# Altium schematic sheet 集成隔离器（4）.SchDoc
size A4
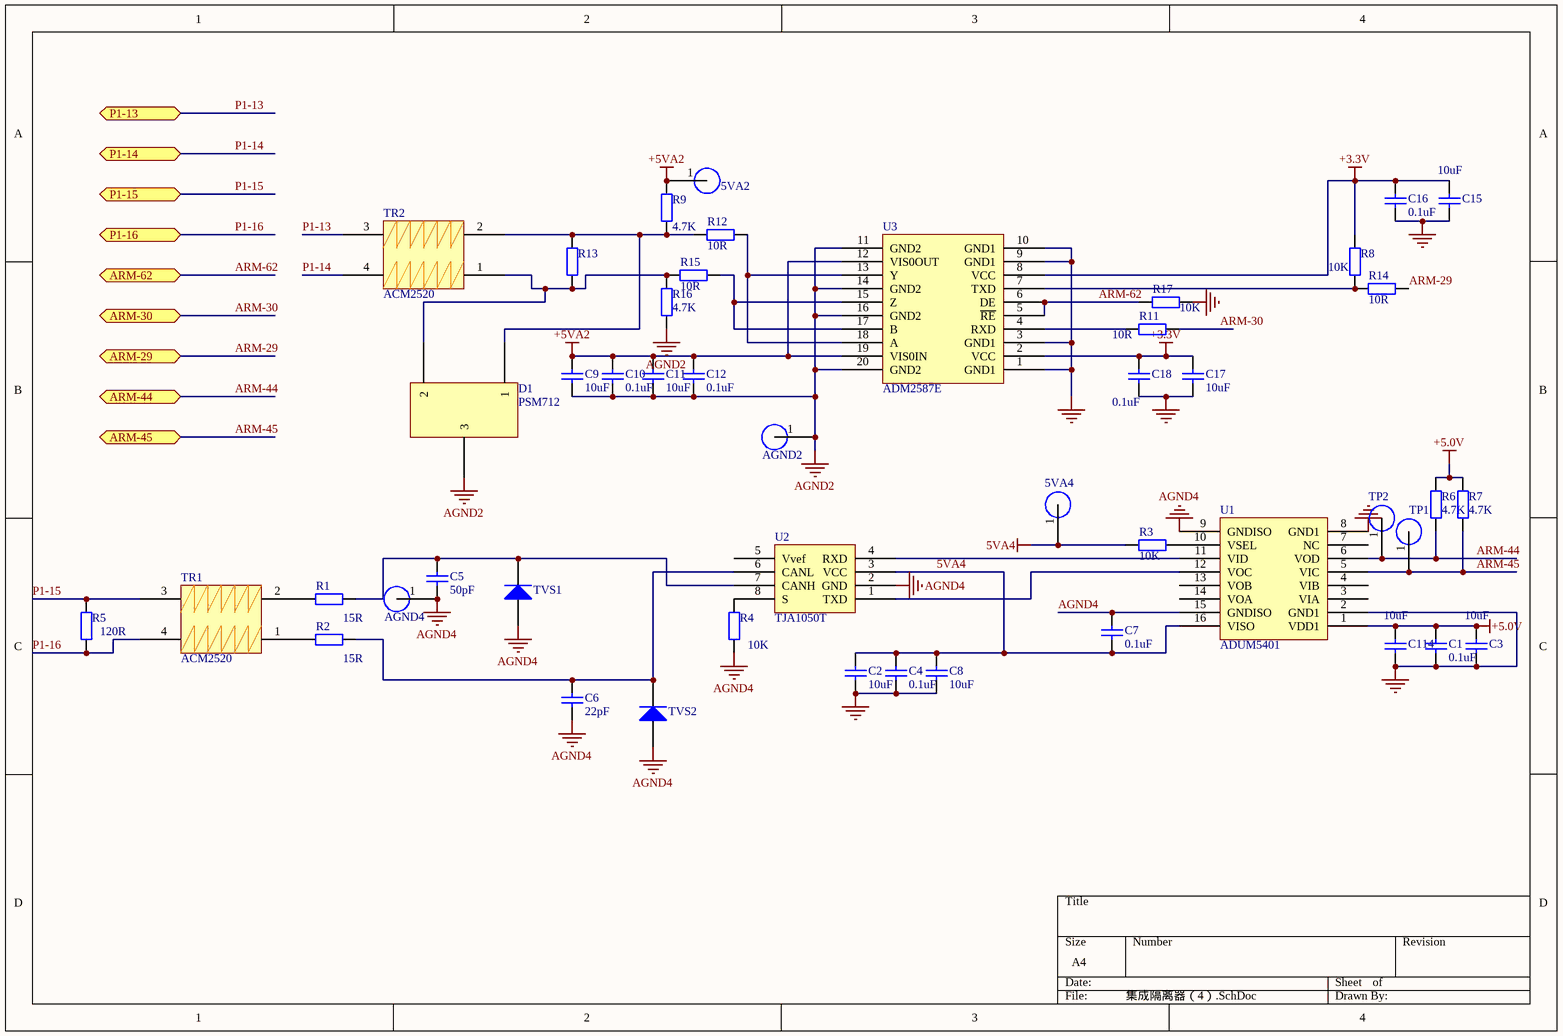
[diagram p0: 集成隔离器（4）.SchDoc]

## Parts
5VA2  PIN  [圆形焊盘]  (value not drawn)
5VA4  PIN  [圆形焊盘]  (value not drawn)
AGND2  PIN  [圆形焊盘]  (value not drawn)
AGND4  PIN  [圆形焊盘]  (value not drawn)
C1  value 0.1uF  [C0805]  (hidden comment: Cap)
C2  value 10uF  [C1206]  (hidden comment: Cap)
C3  value 10uF  [C1206]  (hidden comment: Cap)
C4  value 0.1uF  [C0805]  (hidden comment: Cap)
C5  value 50pF  [C0805]  (hidden comment: Cap)
C6  value 22pF  [C0805]  (hidden comment: Cap)
C7  value 0.1uF  [C0805]  (hidden comment: Cap)
C8  value 10uF  [C1206]  (hidden comment: Cap)
C9  value 10uF  [C1206]  (hidden comment: Cap)
C10  value 0.1uF  [C0805]  (hidden comment: Cap)
C11  value 10uF  [C1206]  (hidden comment: Cap)
C12  value 0.1uF  [C0805]  (hidden comment: Cap)
C15  value 10uF  [C1206]  (hidden comment: Cap)
C16  value 0.1uF  [C0805]  (hidden comment: Cap)
C17  value 10uF  [C1206]  (hidden comment: Cap)
C18  value 0.1uF  [C0805]  (hidden comment: Cap)
C114  value 10uF  [C1206]  (hidden comment: Cap)
D1  PSM712  [SOT23-3]
R1  value 15R  [R0805]  (hidden comment: Res2)
R2  value 15R  [R0805]  (hidden comment: Res2)
R3  value 10K  [R0805]  (hidden comment: Res2)
R4  value 10K  [R0805]  (hidden comment: Res2)
R5  value 120R  [R0805]  (hidden comment: Res2)
R6  value 4.7K  [R0805]  (hidden comment: Res2)
R7  value 4.7K  [R0805]  (hidden comment: Res2)
R8  value 10K  [R0805]  (hidden comment: Res2)
R9  value 4.7K  [R0805]  (hidden comment: Res2)
R11  value 10R  [R0805]  (hidden comment: Res2)
R12  value 10R  [R0805]  (hidden comment: Res2)
R13  Res2  [R0805]  (value not drawn)
R14  value 10R  [R0805]  (hidden comment: Res2)
R15  value 10R  [R0805]  (hidden comment: Res2)
R16  value 4.7K  [R0805]  (hidden comment: Res2)
R17  value 10K  [R0805]  (hidden comment: Res2)
TP1  PIN  [圆形焊盘]  (value not drawn)
TP2  PIN  [圆形焊盘]  (value not drawn)
TR1  ACM2520  [1008]
TR2  ACM2520  [1008]
TVS1  Diode 1N4007  [SMA]  (value not drawn)
TVS2  Diode 1N4007  [SMA]  (value not drawn)
U1  ADUM5401  [SOIC-16]
U2  TJA1050T  [SO-8]
U3  ADM2587E  [SOIC-20]

## Ports
ARM-29, ARM-30, ARM-44, ARM-45, ARM-62, P1-13, P1-14, P1-15, P1-16

## Nets
5VA4: 5VA4.1 C2.2 C4.1 C7.2 C8.2 R3.2 U1.16(VISO) U2.3(VCC)
+3.3V: C15.2 C16.1 C17.1 C18.2 R8.1 U3.2(VCC) U3.8(VCC)
+5.0V: C1.1 C3.2 C114.2 R6.1 R7.1 U1.1(VDD1)
+5VA2: 5VA2.1 C9.1 C10.1 C11.1 C12.2 R9.2 U3.12(VIS0OUT) U3.19(VIS0IN)
AGND2: AGND2.1 C9.2 C10.2 C11.2 C12.1 D1.3 R16.2 U3.11(GND2) U3.14(GND2) U3.16(GND2) U3.20(GND2)
AGND4: AGND4.1 C2.1 C4.2 C5.1 C6.2 C7.1 C8.1 R4.2 TVS1.1(A) TVS2.1(A) U1.9(GNDISO) U1.15(GNDISO) U2.2(GND)
GND: C1.2 C3.1 C15.1 C16.2 C17.2 C18.1 C114.1 R17.2 U1.2(GND1) U1.8(GND1) U3.1(GND1) U3.3(GND1) U3.9(GND1) U3.10(GND1)
ARM-29: R14.1 ; port ARM-29
ARM-30: R11.1 ; port ARM-30
ARM-44: R6.2 TP2.1 U1.6(VOD) ; port ARM-44
ARM-45: R7.2 TP1.1 U1.5(VIC) ; port ARM-45
ARM-62: R17.1 U3.5(~{RE}) U3.6(DE) ; port ARM-62
P1-13: TR2.3 ; port P1-13
P1-14: TR2.4 ; port P1-14
P1-15: R5.2 TR1.3 ; port P1-15
P1-16: R5.1 TR1.4 ; port P1-16
NetC5_2: C5.2 R1.1 TVS1.2(K) U2.7(CANH)
NetC6_1: C6.1 R2.1 TVS2.2(K) U2.6(CANL)
NetD1_1: D1.1 R9.1 R12.1 R13.2 TR2.2
NetD1_2: D1.2 R13.1 R15.1 R16.1 TR2.1
NetR1_2: R1.2 TR1.2
NetR2_2: R2.2 TR1.1
NetR3_1: R3.1 U1.10(VSEL)
NetR4_1: R4.1 U2.8(S)
NetR8_2: R8.2 R14.2 U3.7(TXD)
NetR11_2: R11.2 U3.4(RXD)
NetR12_2: R12.2 U3.13(Y) U3.18(A)
NetR15_2: R15.2 U3.15(Z) U3.17(B)
NetU1_11: U1.11(VID) U2.4(RXD)
NetU1_12: U1.12(VOC) U2.1(TXD)

Not connected (* = marked no-connect by the designer): U1 3(VIA) 4(VIB) 7(NC) 13(VOB) 14(VOA); U2 5(Vvef)

## Library data of the parts
5VA2 5VA4 AGND2 AGND4 D1 TP1 TP2 TR1 TR2 U1-U3 = Component_1
C1-C12 C15-C18 C114 = Cap: Capacitor; Published: 8-Jun-2000; LatestRevisionDate: 17-Jul-2002; LatestRevisionNote: Re-released for DXP Platform.; PackageReference: RAD-0.3; Publisher: Altium Limited
R1-R9 R11 R12 R14-R17 = Res2: Resistor; Published: 8-Jun-2000; LatestRevisionDate: 17-Jul-2002; LatestRevisionNote: Re-released for DXP Platform.; PackageReference: AXIAL-0.4; Publisher: Altium Limited
R13 = Res2: Resistor; Value: NC; Published: 8-Jun-2000; LatestRevisionDate: 17-Jul-2002; LatestRevisionNote: Re-released for DXP Platform.; PackageReference: AXIAL-0.4; Publisher: Altium Limited
TVS1 TVS2 = Diode 1N4007: 1 Amp General Purpose Rectifier; Published: 8-Jun-2000; LatestRevisionDate: 17-Jul-2002; LatestRevisionNote: Re-released for DXP Platform.; DatasheetDocument: 1998; PackageDocument: Aug-1999; PackageReference: DO-41; Publisher: Altium Limited; Code_JEDEC: DO-204-AL; ComponentLink1Description: Manufacturer Link; ComponentLink1URL: http://www.fairchildsemi.com/; ComponentLink2Description: Datasheet; ComponentLink2URL: http://www.fairchildsemi.com/ds/1N%2F1N4001.pdf